# Altium schematic sheet Power_VCC3V3.SchDoc
size A
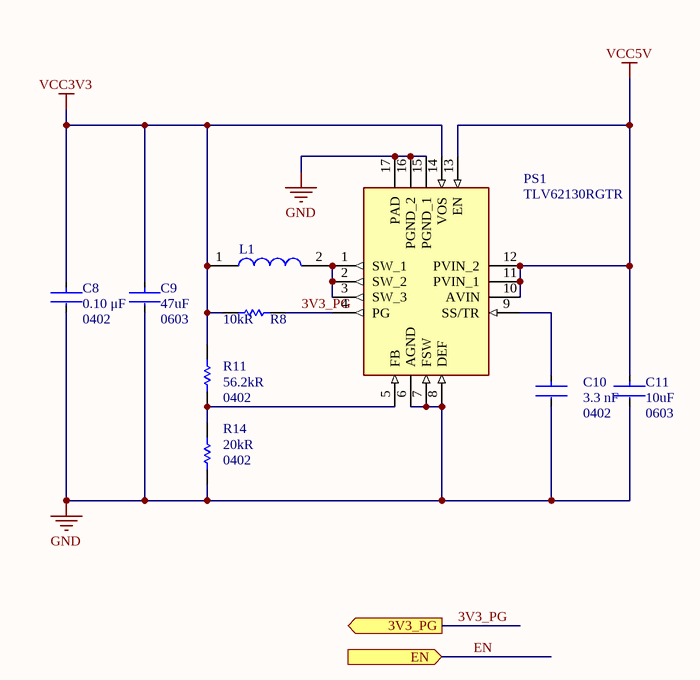
[diagram p0: Power_VCC3V3.SchDoc]

## Parts
C8  value 0.10 μF  Case/Package: 0402  [FP-C0402-BB-MFG]  (hidden comment: C0402C104K8PACTU)
C9  value 47uF  Case Code (Imperial): 0603  [FP-GRM188-0_2-IPC_B]  (hidden comment: GRM188R60J476ME15D)
C10  value 3.3 nF  Case/Package: 0402  [FP-CC0402-MFG]  (hidden comment: CC0402KRX7R9BB332)
C11  value 10uF  Case/Package: 0603  [FP-GRM188-0_1-e0_2_0_55-IPC_A]  (hidden comment: GRM188R60J106ME47D)
L1  252012CDMCDS2R2MC  [INDPM2520X120N]  (value not drawn)
PS1  TLV62130RGTR  [FP-RGT0016C-MFG]
R8  value 10kR  [RESC1005X40X25LL05T10]  (hidden comment: RC0402FR-0710KL)
R11  value 56.2kR  Case/Package: 0402  [RESC1005X40X25NL05T05]  (hidden comment: CRCW040256K2FKED)
R14  value 20kR  Case/Package: 0402  [RESC1005X40X25NL05T10]  (hidden comment: RC0402FR-0720KL)

## Ports
3V3_PG (out), EN (in)

## Nets
GND: C8.2 C9.2 C10.2 C11.2 PS1.6(AGND) PS1.7(FSW) PS1.8(DEF) PS1.15(PGND_1) PS1.16(PGND_2) PS1.17(PAD) R14.1
VCC3V3: C8.1 C9.1 L1.1 PS1.14(VOS) R8.1 R11.2
VCC5V: C11.1 PS1.10(AVIN) PS1.11(PVIN_1) PS1.12(PVIN_2) PS1.13(EN)
3V3_PG: PS1.4(PG) R8.2 ; port 3V3_PG
EN: port EN
NetC10_1: C10.1 PS1.9(SS/TR)
NetL1_2: L1.2 PS1.1(SW_1) PS1.2(SW_2) PS1.3(SW_3)
NetPS1_5: PS1.5(FB) R11.1 R14.2

## Library data of the parts
C8 = CMP-2008-02046-2: CAP CER 0.1UF 10V X5R 0402; Manufacturer: Kemet; Material: Ceramic; Temperature Coefficient: 15%; Tolerance: 0.1; Dissipation Factor: 5%; Package: C0402-BB; Temperature: -55°C to +125°C; ComponentLink2Description: Datasheet; Capacitance: 0.10 μF; Temperature Characteristic: X5R; Device Class L1: Passive Components; Height: 0.55mm; Lead Free: Yes; ComponentLink2URL: https://content.kemet.com/datasheets/KEM_C1002_X7R_SMD.pdf; Device Class L2: Capacitors; Temperature Range Low: -55°C; Temperature Range High: +125°C; RoHS: TRUE; Octopart: https://octopart.com/c0402c104k8pactu-kemet-140039; Automotive: No; Mouser Description: Capacitor 100 nF 10 VDC 0402; Category: Cap; Voltage Rating: 10 V; Digikey Description: CAP CER 0.1UF 10V X5R 0402; Ipc Land Pattern Name: CAPC10050X50; Device Class L3: Ceramic Capacitors; Manufacturer Part Number: C0402C104K8PACTU; Supplier 1: Arrow Electronics; Supplier Part Number 1: C0402C104K8PACTU; Stock 1: 669298; Pricing 1: 1=0.0497, 10=0.0165, 25=0.0164, 100=0.0066, 250=0.0065, 1000=0.0064, 3000=0.0063, 15000=0.0062, 30000=0.0059, 75000=0.0057 (USD); Mounting Technology: Surface Mount,PCB; Pins: 2; Case Code (Metric): 1005; Case Code (Imperial): 0402; Dielectric Material: Ceramic; Min Operating Temperature: -55°C; Max Operating Temperature: 85°C; Packaging: Tape and Reel; Dielectric: X5R; Series: SMD Comm X5R; Voltage: 10V; Voltage Rating (DC): 10V; Package Quantity: 10000; Termination: SMD/SMT; Construction: Flat; Length: 1mm; Width: 0.5mm; Depth: 0.5mm; Lead Pitch: 0.3mm; Radiation Hardening: No; RoHS Compliant: Yes; Reach SVHC Compliant: No
C9 = CMP-2000-05444-2: Chip Multilayer Ceramic Capacitors for General Purpose, 0603, 47uF, X5R, 15%, 20%, 6.3V; Manufacturer: Murata; Voltage Rating (DC): 6.3V; Thickness: 0.039inch; Packaging: Tape and Reel; Capacitance: 47uF; Width: 0.031inch; Dielectric: X5R; Max Operating Temperature: 85°C; Mount: Surface Mount; Case Code (Metric): 1608; Length: 0.063inch; Voltage Rating: 6.3V; Tolerance: 20%; Case/Package: 0603; Min Operating Temperature: -55°C; Supplier 1: Arrow Electronics; Supplier Part Number 1: GRM188R60J476ME15D; Manufacturer Part Number: GRM188R60J476ME15D; RoHS: Yes; Category: Ceramic Capacitors; Stock 1: 344000; Pricing 1: 4000=0.1103, 8000=0.1056, 12000=0.1038, 28000=0.1013, 100000=0.0967 (USD); Mounting Technology: Surface Mount; Series: GRM; RoHS Compliant: Yes; ComponentLink1URL: http://search.murata.co.jp/Ceramy/image/img/A01X/G101/ENG/GRM188R60J476ME15-01.pdf?src-supplier=Digi-Key; ComponentLink1Description: http://search.murata.co.jp/Ceramy/image/img/A01X/G101/ENG/GRM188R60J476ME15-01.pdf?src-supplier=Digi-Key; ComponentLink2URL: https://www.murata.com/~/media/webrenewal/support/library/catalog/products/capacitor/mlcc/c02e.ashx?la=en-us&src-supplier=Digi-Key; ComponentLink2Description: https://www.murata.com/~/media/webrenewal/support/library/catalog/products/capacitor/mlcc/c02e.ashx?la=en-us&src-supplier=Digi-Key
C10 = CMP-1034-01779-2: CAP CER 3300PF 50V X7R 0402; Manufacturer: YAGEO; Temperature Coefficient: 30ppm/°C; Material: Ceramic; Tolerance: 0.1; Automotive Grade: NA; Insulation Resistance: 100GR; ComponentLink2Description: Datasheet; ComponentLink2URL: http://www.yageo.com/documents/recent/UPY-GP_NP0_16V-to-50V_16.pdf; Package: CC0402; Temperature Range High: +125°C; Ipc Land Pattern Name: CAPC10050X50; Octopart: https://octopart.com/cc0402krx7r9bb332-yageo-192887; RoHS: TRUE; Automotive: No; Lead Free: Yes; Temperature Characteristic: X7R; Temperature: -55°C to +125°C; Height: 0.55mm; Category: Cap; Footprint Url: http://www.yageo.com/exep/pages/download/literatures/UPY-C_GEN_24.pdf; Device Class L2: Capacitors; Device Class L3: Ceramic Capacitors; Digikey Description: CAP CER 3300PF 50V X7R 0402; Temperature Range Low: -55°C; Manufacturer Part Number: CC0402KRX7R9BB332; Voltage Rating: 50 V; Mouser Description: Multilayer Ceramic Capacitors MLCC - SMD/SMT 3.3nF 50V X7R 10%; Device Class L1: Passive Components; Capacitance: 3.3 nF; Supplier 1: Future Electronics; Supplier Part Number 1: 9776550; Stock 1: 250000; Pricing 1: 10000=0.0021, 40000=0.002, 150000=0.0019, 400000=0.0019, 1000000=0.0017 (USD); Mounting Technology: Surface Mount; Pins: 2; Case Code (Metric): 1005; Case Code (Imperial): 0402; Dielectric Material: Ceramic; Min Operating Temperature: -55°C; Max Operating Temperature: 125°C; Packaging: Tape and Reel; Dielectric: X7R; Series: CC; Voltage Rating (DC): 50V; Termination: SMD/SMT; Package Quantity: 1; Voltage: 50V; Length: 1mm; Width: 0.02inch; Thickness: 0.022inch; Depth: 0.5mm; Terminal Length: 0.225mm; Radiation Hardening: No; RoHS Compliant: Yes; Reach SVHC Compliant: No; Halogen Free: Halogen Free; ComponentLink1URL: https://datasheet.ciiva.com/144/mlccorderingcode-144014.pdf?src-supplier=Digi-Key; ComponentLink1Description: https://datasheet.ciiva.com/144/mlccorderingcode-144014.pdf?src-supplier=Digi-Key; ComponentLink3URL: https://datasheet.ciiva.com/144/mlccorderingcode-144013.pdf?src-supplier=Digi-Key; ComponentLink3Description: https://datasheet.ciiva.com/144/mlccorderingcode-144013.pdf?src-supplier=Digi-Key; ComponentLink4URL: https://datasheet.ciiva.com/144/mlccorderingcode-144015.pdf?src-supplier=Digi-Key; ComponentLink4Description: https://datasheet.ciiva.com/144/mlccorderingcode-144015.pdf?src-supplier=Digi-Key; ComponentLink5URL: https://datasheet.ciiva.com/11786/0900766b80d84f1d-11786153.pdf?src-supplier=Rs; ComponentLink5Description: https://datasheet.ciiva.com/11786/0900766b80d84f1d-11786153.pdf?src-supplier=Rs; ComponentLink6URL: https://datasheet.ciiva.com/7978/1489800-7978103.pdf?src-supplier=Element14; ComponentLink6Description: https://datasheet.ciiva.com/7978/1489800-7978103.pdf?src-supplier=Element14; ComponentLink7URL: https://datasheet.ciiva.com/28450/1489800-28450409.pdf?src-supplier=Element14; ComponentLink7Description: https://datasheet.ciiva.com/28450/1489800-28450409.pdf?src-supplier=Element14; ComponentLink8URL: https://datasheet.ciiva.com/5789/1489800-5789558.pdf?src-supplier=Farnell; ComponentLink8Description: https://datasheet.ciiva.com/5789/1489800-5789558.pdf?src-supplier=Farnell; ComponentLink9URL: https://datasheet.ciiva.com/8033/1489800-8033630.pdf?src-supplier=Element14; ComponentLink9Description: https://datasheet.ciiva.com/8033/1489800-8033630.pdf?src-supplier=Element14; ComponentLink10URL: https://datasheet.ciiva.com/22745/1489800-22745767.pdf?src-supplier=Element14; ComponentLink10Description: https://datasheet.ciiva.com/22745/1489800-22745767.pdf?src-supplier=Element14; ComponentLink11URL: https://datasheet.ciiva.com/5425/upy-gphc-x7r-6-3v-to-50v-8-12304-5425518.pdf?src-supplier=Mouser; ComponentLink11Description: https://datasheet.ciiva.com/5425/upy-gphc-x7r-6-3v-to-50v-8-12304-5425518.pdf?src-supplier=Mouser; ComponentLink12URL: https://datasheet.ciiva.com/11586/upy-gphc-x7r-6-3v-to-50v-8-11586486.pdf?src-supplier=Avnet; ComponentLink12Description: https://datasheet.ciiva.com/11586/upy-gphc-x7r-6-3v-to-50v-8-11586486.pdf?src-supplier=Avnet; ComponentLink13URL: https://datasheet.ciiva.com/15189/getdatasheetpartid-315557-15189133.pdf?src-supplier=Verical; ComponentLink13Description: https://datasheet.ciiva.com/15189/getdatasheetpartid-315557-15189133.pdf?src-supplier=Verical
C11 = CMP-2006-02792-2: Chip Multilayer Ceramic Capacitors for General Purpose, 0603, 10uF, X5R, 15%, 20%, 6.3V; Manufacturer: Murata; Packaging: Tape and Reel; Voltage Rating (DC): 6.3V; Width: 0.031inch; Termination: SMD/SMT; Dielectric: X5R; Package Quantity: 4000; Voltage Rating: 6.3V; Capacitance: 10uF; Min Operating Temperature: -55°C; Voltage: 6.3V; Length: 1.6mm; Thickness: 0.035inch; Lead Free: Lead Free; Depth: 0.8mm; Case Code (Imperial): 0603; Max Operating Temperature: 85°C; Material: Ceramic; Height: 0.8mm; Tolerance: 20%; Mount: Surface Mount; REACH SVHC: No SVHC; Radiation Hardening: No; Case Code (Metric): 1608; Supplier 1: Arrow Electronics; Supplier Part Number 1: GRM188R60J106ME47D; Manufacturer Part Number: GRM188R60J106ME47D; RoHS: Yes; Category: Ceramic Capacitors; Stock 1: 39940; Pricing 1: 1=0.1517, 10=0.0717, 25=0.0709, 100=0.0414, 250=0.0393, 500=0.0387, 1000=0.031, 3000=0.0287, 6000=0.0284, 15000=0.0223, 30000=0.0194 (USD); Mounting Technology: Surface Mount; Weight: 0.000222oz; Series: GRM; RoHS Compliant: Yes
L1 = 252012CDMCDS2R2MC: Inductor; Manufacturer_Name: Sumida; Manufacturer_Part_Number: 252012CDMCDS‐2R2MC; Datasheet Link: https://products.sumida.com/products/pdf/252012CDMCDDS%20(en).pdf; Height: 1.2mm; Supplier 1: Mouser; Supplier Part Number 1: 851-252012CDMCDDSR2C; Supplier 2: Digi-Key; Supplier Part Number 2: 308-2605-2-ND
PS1 = TLV62130RGTR: Buck Switching Regulator IC Positive Adjustable 0.9V 1 Output 3A 16-VFQFN Exposed Pad; Manufacturer_Name: Texas Instruments; Max Supply Voltage: 17V; Output Voltage: 5V; Min Input Voltage: 4V; Number of Outputs: 1; Switching Frequency: 2.5MHz; Synchronous Rectifier: Yes; Min Output Voltage: 900mV; Quiescent Current: 19uA; Datasheet Link: http://www.ti.com/lit/gpn/tlv62130; Height: 1mm; Manufacturer_Part_Number: TLV62130RGTR; Arrow Part Number: TLV62130RGTR; Arrow Price/Stock: https://www.arrow.com/en/products/tlv62130rgtr/texas-instruments; Mouser Part Number: 595-TLV62130RGTR; Mouser Price/Stock: https://www.mouser.co.uk/ProductDetail/Texas-Instruments/TLV62130RGTR?qs=2UFnnMkojnVB1OajUwDmow%3D%3D; Supplier 1: Mouser; Manufacturer: Texas Instruments; Manufacturer Part Number: TLV62130RGTR; RoHS: Yes; Category: Voltage Regulators - Switching; Stock 1: 54615; Pricing 1: 1=1.72, 10=1.55, 50=1.46, 100=1.24, 1000=0.846, 10000=0.809 (USD); Mounting Technology: Surface Mount; Case/Package: QFN; Pins: 16; Weight: 0.001623oz; Min Operating Temperature: -40°C; Max Operating Temperature: 85°C; Output Current: 3A; Packaging: Tape and Reel; Package Quantity: 1; Min Supply Voltage: 4V; Max Output current: 3A; Max Output Voltage: 5V; Operating Supply Current: 19uA; Output Type: Adjustable; Series: DCS-Control™; Length: 3.15mm; Width: 3.15mm; Reach SVHC Compliant: No; Lead Free: Lead Free; RoHS Compliant: Yes; ComponentLink1URL: https://datasheet.ciiva.com/4879/slvsb74-121317-4879137.pdf?src-supplier=Mouser; ComponentLink1Description: https://datasheet.ciiva.com/4879/slvsb74-121317-4879137.pdf?src-supplier=Mouser; ComponentLink2URL: https://datasheet.ciiva.com/18553/tlv62130-18553005.pdf?src-supplier=Digi-Key; ComponentLink2Description: https://datasheet.ciiva.com/18553/tlv62130-18553005.pdf?src-supplier=Digi-Key; ComponentLink3URL: https://datasheet.ciiva.com/18553/tlv62130-18553004.pdf?src-supplier=Digi-Key; ComponentLink3Description: https://datasheet.ciiva.com/18553/tlv62130-18553004.pdf?src-supplier=Digi-Key; ComponentLink4URL: https://datasheet.ciiva.com/18553/tlv62130-18553006.pdf?src-supplier=Digi-Key; ComponentLink4Description: https://datasheet.ciiva.com/18553/tlv62130-18553006.pdf?src-supplier=Digi-Key; ComponentLink5URL: https://datasheet.ciiva.com/14377/tlv62130-14377870.pdf?src-supplier=Avnet; ComponentLink5Description: https://datasheet.ciiva.com/14377/tlv62130-14377870.pdf?src-supplier=Avnet; Supplier 2: Digi-Key; Stock 2: 27073; Pricing 2: 1=1.62, 10=1.458, 25=1.3752, 100=1.1715, 250=1.1, 500=0.9625, 1000=0.825 (USD); Supplier Part Number 1: 595-TLV62130RGTR; Supplier Part Number 2: 296-35978-6-ND
R8 = CMP-2002-07353-1: 10K 0402 1% 1/16W +-100PPM; Manufacturer: Yageo / Phycomp; Power Rating: 62.5mW; Max Power Dissipation: 63mW; Voltage Rating: 50V; Temperature Coefficient: 100ppm/°C; Description: Res General Purpose Thick Film 0402 10K Ohm 1% 1/16W ±100ppm/°C Molded SMD Paper T/R; Part Number: RC0402FR-0710KL; Supplier 1: Future Electronics; Supplier Part Number 1: 7468275; Manufacturer Part Number: RC0402FR-0710KL; RoHS: Yes; Category: Chip SMD Resistors; Stock 1: 2365; Pricing 1: 1=0.1, 20=0.0679, 150=0.0464, 1000=0.0261, 5000=0.0089 (USD); Case/Package: 0402; Pins: 2; Case Code (Imperial): 0402; Case Code (Metric): 1005; Min Operating Temperature: -55°C; Max Operating Temperature: 155°C; Tolerance: 1%; Packaging: Tape and Reel; Termination: SMD/SMT; Series: RC; Resistance Tolerance: 1%; Resistor Type: Thick Film; Voltage Rating (DC): 50V; Number of Terminations: 2; Features: Moisture Resistant; Construction: Rectangular; Length: 1mm; Width: 0.5mm; Depth: 0.5mm; Lead Pitch: 0.2mm; Reach SVHC Compliant: Unknown; Lead Free: Lead Free; RoHS Compliant: Yes; Military Standard: Not; ComponentLink1URL: https://datasheet.ciiva.com/7660/38568-7660787.pdf?src-supplier=Element14; ComponentLink1Description: https://datasheet.ciiva.com/7660/38568-7660787.pdf?src-supplier=Element14; ComponentLink2URL: https://datasheet.ciiva.com/7849/1686128-7849814.pdf?src-supplier=Element14; ComponentLink2Description: https://datasheet.ciiva.com/7849/1686128-7849814.pdf?src-supplier=Element14; ComponentLink3URL: https://datasheet.ciiva.com/7983/1018594-7983486.pdf?src-supplier=Element14; ComponentLink3Description: https://datasheet.ciiva.com/7983/1018594-7983486.pdf?src-supplier=Element14; ComponentLink4URL: https://datasheet.ciiva.com/22747/1018594-22747512.pdf?src-supplier=Element14; ComponentLink4Description: https://datasheet.ciiva.com/22747/1018594-22747512.pdf?src-supplier=Element14; ComponentLink5URL: https://datasheet.ciiva.com/12667/pyu-rc0402-51-rohs-l-6-r-12667067.pdf?src-supplier=Mouser; ComponentLink5Description: https://datasheet.ciiva.com/12667/pyu-rc0402-51-rohs-l-6-r-12667067.pdf?src-supplier=Mouser; ComponentLink6URL: https://datasheet.ciiva.com/7849/1784430-7849813.pdf?src-supplier=Element14; ComponentLink6Description: https://datasheet.ciiva.com/7849/1784430-7849813.pdf?src-supplier=Element14; ComponentLink7URL: https://datasheet.ciiva.com/7849/1784430-7849815.pdf?src-supplier=Element14; ComponentLink7Description: https://datasheet.ciiva.com/7849/1784430-7849815.pdf?src-supplier=Element14
R11 = CMP-2002-00103-1: Manufacturer: Vishay Dale; Power Rating: 63mW; Tolerance: 1%; Temperature Coefficient: 100ppm/°C; Voltage Rating: 50V; Part Number: CRCW040256K2FKED; Supplier 1: Mouser; Supplier Part Number 1: 71-CRCW0402-56.2K-E3; Manufacturer Part Number: CRCW040256K2FKED; RoHS: Yes; Category: Chip SMD Resistors; Stock 1: 1483699; Pricing 1: 1=0.1, 10=0.038, 50=0.038, 100=0.016, 1000=0.007, 10000=0.004 (USD); Pins: 2; Case Code (Metric): 1005; Case Code (Imperial): 0402; Weight: 2.3E-05oz; Contact Plating: Tin; Min Operating Temperature: -55°C; Max Operating Temperature: 155°C; Packaging: Tape and Reel; Number of Terminations: 2; Max Power Dissipation: 63mW; Series: CRCW; Package Quantity: 10000; Termination: SMD/SMT; Features: Automotive AEC-Q200; Construction: Rectangular; Resistor Type: Thick Film; Resistance Tolerance: 1%; Technology: THICK FILM; Length: 1mm; Width: 0.5mm; Height: 0.35mm; Depth: 0.5mm; Ratings: AEC-Q200; Radiation Hardening: No; RoHS Compliant: Yes; Military Standard: Not; Reach SVHC Compliant: Unknown; ComponentLink1URL: https://datasheet.ciiva.com/11818/0900766b80d98824-11818112.pdf?src-supplier=Rs; ComponentLink1Description: https://datasheet.ciiva.com/11818/0900766b80d98824-11818112.pdf?src-supplier=Rs; ComponentLink2URL: https://datasheet.ciiva.com/2495/dcrcwe3-2495024.pdf?src-supplier=Digi-Key; ComponentLink2Description: https://datasheet.ciiva.com/2495/dcrcwe3-2495024.pdf?src-supplier=Digi-Key; ComponentLink3URL: https://datasheet.ciiva.com/2495/dcrcwe3-2495025.pdf?src-supplier=Digi-Key; ComponentLink3Description: https://datasheet.ciiva.com/2495/dcrcwe3-2495025.pdf?src-supplier=Digi-Key; ComponentLink4URL: https://datasheet.ciiva.com/5547/dcrcwe3-109170-5547253.pdf?src-supplier=Mouser; ComponentLink4Description: https://datasheet.ciiva.com/5547/dcrcwe3-109170-5547253.pdf?src-supplier=Mouser; ComponentLink5URL: https://datasheet.ciiva.com/16780/70201119-16780487.pdf?src-supplier=Allied+Electronics; ComponentLink5Description: https://datasheet.ciiva.com/16780/70201119-16780487.pdf?src-supplier=Allied+Electronics; ComponentLink6URL: https://datasheet.ciiva.com/16394/dcrcwe3-16394266.pdf?src-supplier=Future+Electronics; ComponentLink6Description: https://datasheet.ciiva.com/16394/dcrcwe3-16394266.pdf?src-supplier=Future+Electronics; ComponentLink7URL: https://datasheet.ciiva.com/7815/1697337-7815996.pdf?src-supplier=Element14; ComponentLink7Description: https://datasheet.ciiva.com/7815/1697337-7815996.pdf?src-supplier=Element14; ComponentLink8URL: https://datasheet.ciiva.com/2495/dcrcwe3-2495023.pdf?src-supplier=Digi-Key; ComponentLink8Description: https://datasheet.ciiva.com/2495/dcrcwe3-2495023.pdf?src-supplier=Digi-Key
R14 = CMP-2002-07501-1: Manufacturer: Yageo / Phycomp; Power Rating: 62.5mW; Voltage Rating: 50V; Temperature Coefficient: 100ppm/°C; Max Power Dissipation: 63mW; Resistance Tolerance: 1%; Part Number: RC0402FR-0720KL; Supplier 1: Future Electronics; Supplier Part Number 1: 4649547; Manufacturer Part Number: RC0402FR-0720KL; RoHS: Yes; Category: Chip SMD Resistors; Stock 1: 18530000; Pricing 1: 10000=0.001, 50000=0.001, 300000=0.0009, 1000000=0.0009, 3000000=0.0008 (USD); Pins: 2; Case Code (Metric): 1005; Case Code (Imperial): 0402; Min Operating Temperature: -55°C; Max Operating Temperature: 155°C; Packaging: Tape and Reel; Resistor Type: Thick Film; Number of Terminations: 2; Termination: SMD/SMT; Voltage Rating (DC): 50V; Series: RC; Tolerance: 1%; Features: Moisture Resistant; Technology: THICK FILM; Package Quantity: 1; Construction: Rectangular; Length: 1mm; Width: 0.02inch; Height: 0.016inch; Depth: 0.5mm; Reach SVHC Compliant: No; RoHS Compliant: Yes; Lead Free: Lead Free; Military Standard: Not; ComponentLink1URL: https://datasheet.ciiva.com/11808/0900766b80c66297-11808454.pdf?src-supplier=Rs; ComponentLink1Description: https://datasheet.ciiva.com/11808/0900766b80c66297-11808454.pdf?src-supplier=Rs; ComponentLink2URL: https://datasheet.ciiva.com/7983/1018594-7983511.pdf?src-supplier=Element14; ComponentLink2Description: https://datasheet.ciiva.com/7983/1018594-7983511.pdf?src-supplier=Element14; ComponentLink3URL: https://datasheet.ciiva.com/46394/1018594-46394974.pdf?src-supplier=Element14; ComponentLink3Description: https://datasheet.ciiva.com/46394/1018594-46394974.pdf?src-supplier=Element14; ComponentLink4URL: https://datasheet.ciiva.com/2453/pyu-r-int-thick-7-2453494.pdf?src-supplier=Digi-Key; ComponentLink4Description: https://datasheet.ciiva.com/2453/pyu-r-int-thick-7-2453494.pdf?src-supplier=Digi-Key; ComponentLink5URL: https://datasheet.ciiva.com/2453/pyu-r-int-thick-7-2453495.pdf?src-supplier=Digi-Key; ComponentLink5Description: https://datasheet.ciiva.com/2453/pyu-r-int-thick-7-2453495.pdf?src-supplier=Digi-Key; ComponentLink6URL: https://datasheet.ciiva.com/2453/pyu-r-int-thick-7-2453493.pdf?src-supplier=Digi-Key; ComponentLink6Description: https://datasheet.ciiva.com/2453/pyu-r-int-thick-7-2453493.pdf?src-supplier=Digi-Key; ComponentLink7URL: https://datasheet.ciiva.com/12558/pyu-rc0402-51-rohs-l-6-r-8721-12558796.pdf?src-supplier=Mouser; ComponentLink7Description: https://datasheet.ciiva.com/12558/pyu-rc0402-51-rohs-l-6-r-8721-12558796.pdf?src-supplier=Mouser